# Altium schematic sheet Interfaces and Connectors.SCHDOC
size A4
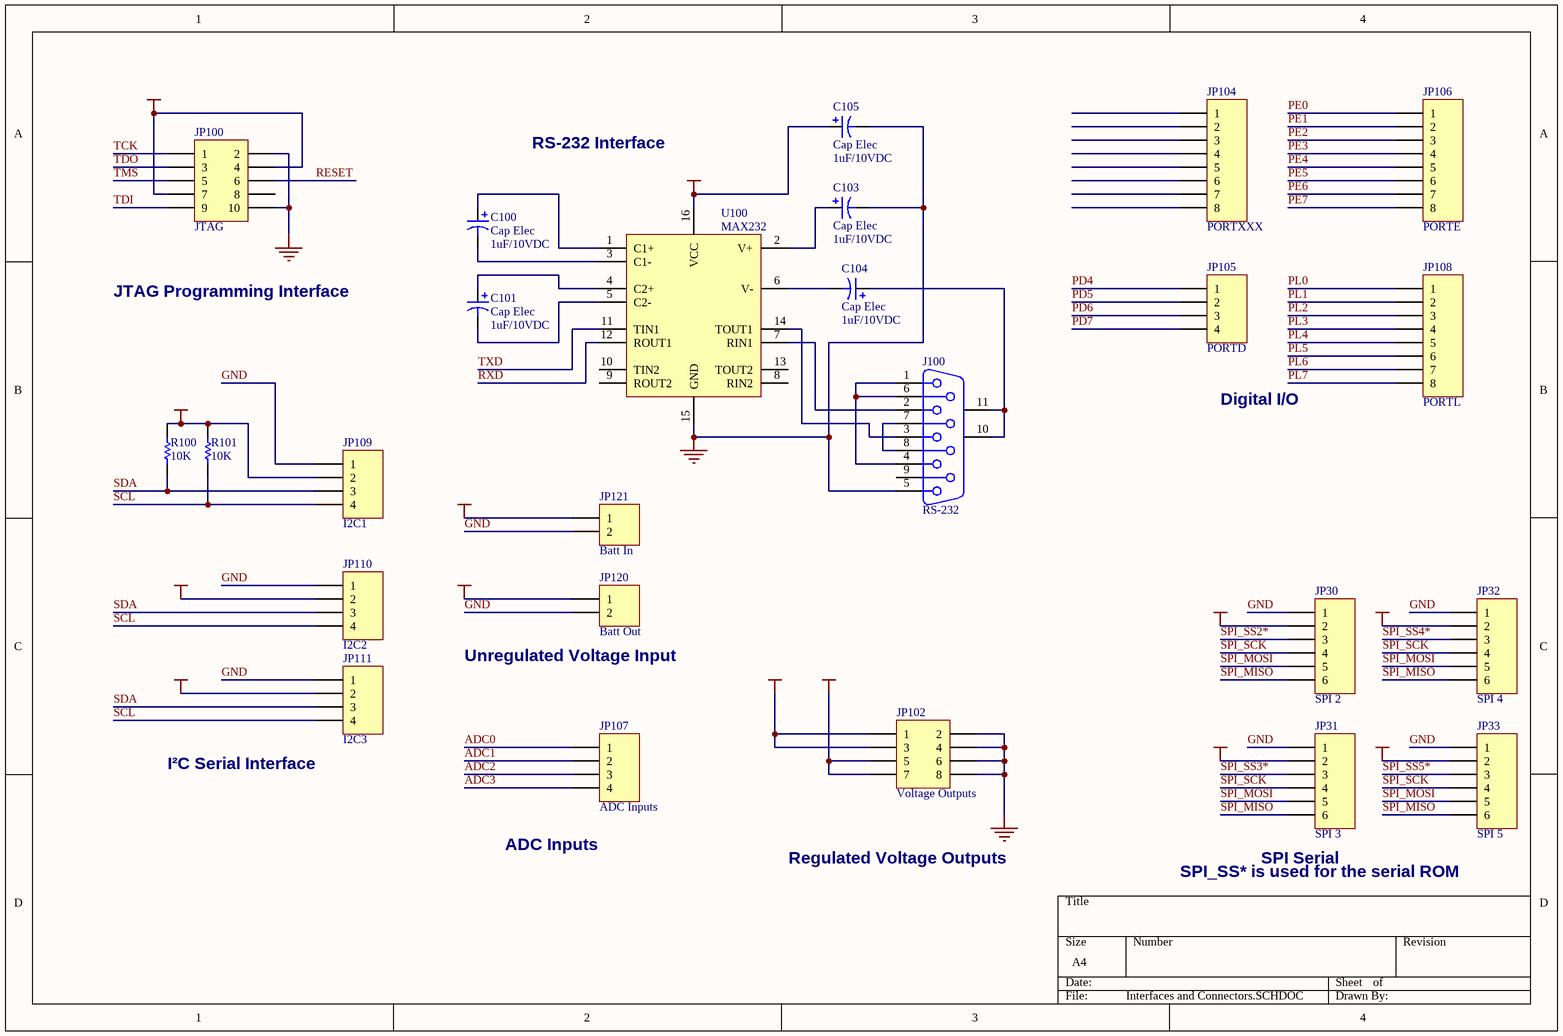
[diagram p0: Interfaces and Connectors.SCHDOC]

## Parts
C100  Cap Elec  value 1uF/10VDC  [CAPR5-4X5]
C101  Cap Elec  value 1uF/10VDC  [CAPR5-4X5]
C103  Cap Elec  value 1uF/10VDC  [CAPR5-4X5]
C104  Cap Elec  value 1uF/10VDC  [CAPR5-4X5]
C105  Cap Elec  value 1uF/10VDC  [CAPR5-4X5]
J100  RS-232  [DSUB1.385-2H9]
JP30  SPI 2  [HDR1X6]
JP31  SPI 3  [HDR1X6]
JP32  SPI 4  [HDR1X6]
JP33  SPI 5  [HDR1X6]
JP100  JTAG  [HDR2X5]
JP102  Voltage Outputs  [HDR2X4]
JP104  PORTXXX  [HDR1X8]
JP105  PORTD  [HDR1X4]
JP106  PORTE  [HDR1X8]
JP107  ADC Inputs  [HDR1X4]
JP108  PORTL  [HDR1X8]
JP109  I2C1  [HDR1X4]
JP110  I2C2  [HDR1X4]
JP111  I2C3  [HDR1X4]
JP120  Batt Out  [HDR1X2]
JP121  Batt In  [HDR1X2]
R100  10K  [AXIAL-0.3]
R101  10K  [AXIAL-0.3]
U100  MAX232  [SO-G16/C5.85]

## Nets
5V: C105.1 JP30.2 JP31.2 JP32.2 JP33.2 JP100.4 JP100.7 JP102.5 JP102.7 JP109.2 JP110.2 JP111.2 R100.2 R101.2 U100.16(VCC)
9V: JP102.1 JP102.3
GND: C103.2 C105.2 J100.5 JP30.1 JP31.1 JP32.1 JP33.1 JP100.2 JP100.10 JP102.2 JP102.4 JP102.6 JP102.8 JP109.1 JP110.1 JP111.1 JP120.2 JP121.2 U100.15(GND)
VBat: JP120.1 JP121.1
ADC0: JP107.1
ADC1: JP107.2
ADC2: JP107.3
ADC3: JP107.4
PD4: JP105.1
PD5: JP105.2
PD6: JP105.3
PD7: JP105.4
PE0: JP106.1
PE1: JP106.2
PE2: JP106.3
PE3: JP106.4
PE4: JP106.5
PE5: JP106.6
PE6: JP106.7
PE7: JP106.8
PL0: JP108.1
PL1: JP108.2
PL2: JP108.3
PL3: JP108.4
PL4: JP108.5
PL5: JP108.6
PL6: JP108.7
PL7: JP108.8
RESET: JP100.6
RXD: U100.12(ROUT1)
SCL: JP109.4 JP110.4 JP111.4 R101.1
SDA: JP109.3 JP110.3 JP111.3 R100.1
SPI_MISO: JP30.6 JP31.6 JP32.6 JP33.6
SPI_MOSI: JP30.5 JP31.5 JP32.5 JP33.5
SPI_SCK: JP30.4 JP31.4 JP32.4 JP33.4
SPI_SS2*: JP30.3
SPI_SS3*: JP31.3
SPI_SS4*: JP32.3
SPI_SS5*: JP33.3
TCK: JP100.1
TDI: JP100.9
TDO: JP100.3
TMS: JP100.5
TXD: U100.11(TIN1)
NetC100_1: C100.1 U100.1(C1+)
NetC100_2: C100.2 U100.3(C1-)
NetC101_1: C101.1 U100.4(C2+)
NetC101_2: C101.2 U100.5(C2-)
NetC103_1: C103.1 U100.2(V+)
NetC104_1: C104.1 J100.10(MH1) J100.11(MH2)
NetC104_2: C104.2 U100.6(V-)
NetJ100_1: J100.1 J100.4 J100.6
NetJ100_2: J100.2 U100.7(RIN1)
NetJ100_3: J100.3 U100.14(TOUT1)
NetJ100_7: J100.7 J100.8

Not connected (* = marked no-connect by the designer): J100 9; JP100 8; JP104 1 2 3 4 5 6 7 8; U100 8(RIN2) 9(ROUT2) 10(TIN2) 13(TOUT2)

## Notes on the sheet
- RS-232 Interface
- JTAG Programming Interface
- Digital I/O
- (near JP120) Unregulated Voltage Input
- (near JP111) I²C Serial Interface
- (near JP107) ADC Inputs
- Regulated Voltage Outputs
- SPI_SS* is used for the serial ROM
- (near JP31) SPI Serial

## Library data of the parts
C100 C101 C103-C105 = Cap Pol2: Polarized Capacitor (Axial); Published: 8-Jun-2000; Revision: July-2002: Re-released for DXP Platform.; Publisher: Altium Limited
J100 = D Connector 9: Receptacle Assembly, 9 Position, Right Angle; Package Information: Latest Revision: O; Positions: 9; Published: 15-Jun-2001; Revision: 17-Jul-2002: Re-released for DXP Platform.; Datasheet: (1-Sep-1999); Package Reference: 788750; Publisher: Altium Limited; Orientation: Right Angle; Gender: Receptacle
JP30-JP33 = Header 6: Header, 6-Pin; Revision: 17-Jul-2002: Re-released for DXP Platform.; Publisher: Altium Limited
JP100 = Header 5X2: Header, 5-Pin, Dual row; Revision: 17-Jul-2002: Re-released for DXP Platform.; Publisher: Altium Limited
JP102 = Header 4X2: Header, 4-Pin, Dual row; Revision: 17-Jul-2002: Re-released for DXP Platform.; Publisher: Altium Limited
JP104 JP106 JP108 = Header 8: Header, 8-Pin; Revision: 17-Jul-2002: Re-released for DXP Platform.; Publisher: Altium Limited
JP105 JP107 JP109-JP111 = Header 4: Header, 4-Pin; Revision: 17-Jul-2002: Re-released for DXP Platform.; Publisher: Altium Limited
JP120 JP121 = Header 2: Header, 2-Pin; Revision: 17-Jul-2002: Re-released for DXP Platform.; Publisher: Altium Limited
R100 R101 = Res1: Resistor; Published: 8-Jun-2000; Revision: July-2002: Re-released for DXP Platform.; Publisher: Altium Limited
U100 = MAX232: Maxim RS-232 Transceiver